# EAGLE design maymusicbox (EAGLE 7.7.0)
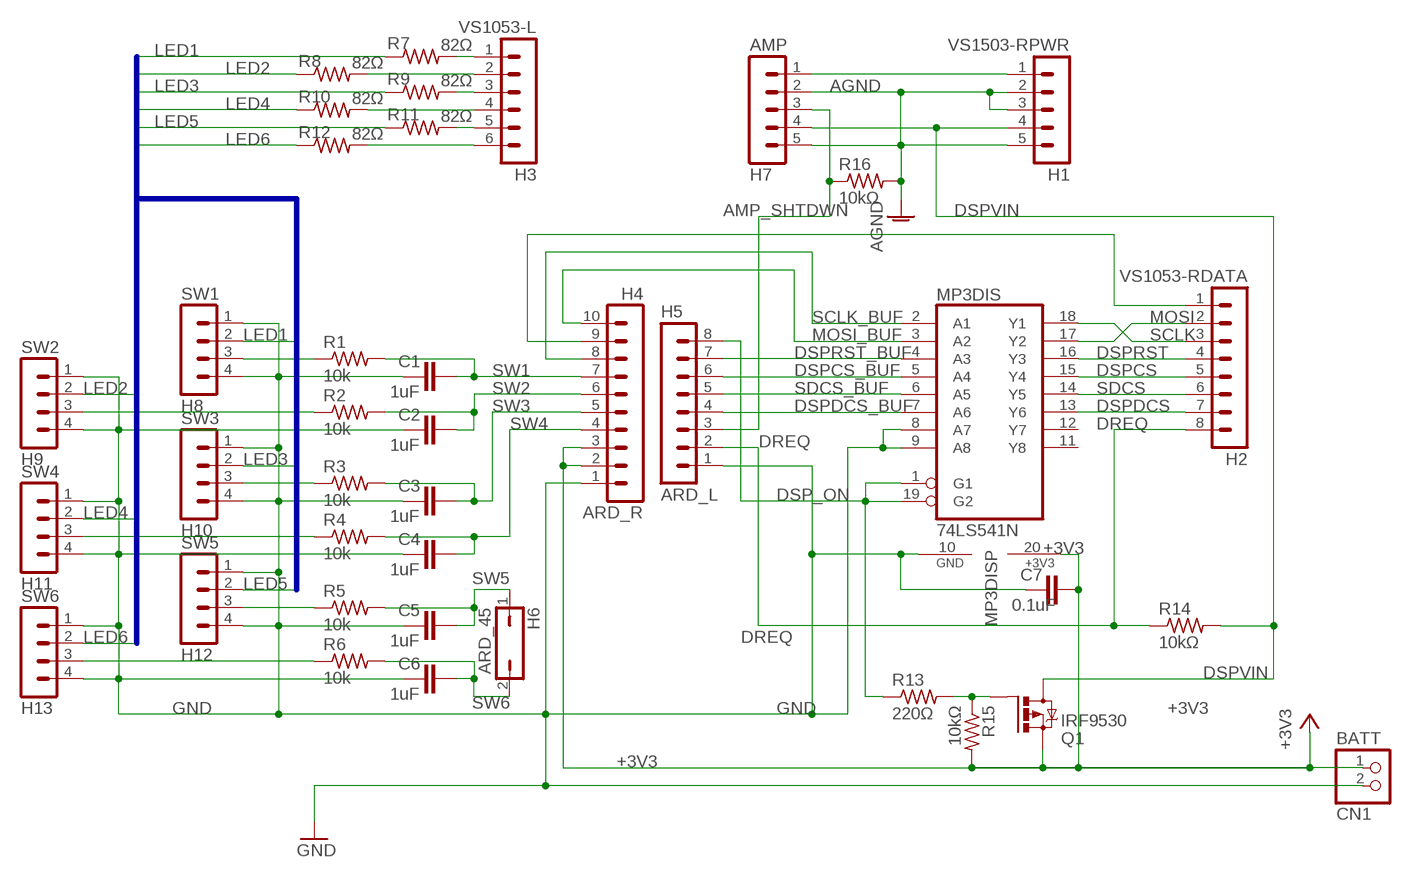
[diagram p0: schematic, sheet 1]

## Parts
C1  1uF  C-EU025-025X050  [C025-025X050]
C2  1uF  C-EU025-025X050  [C025-025X050]
C3  1uF  C-EU025-025X050  [C025-025X050]
C4  1uF  C-EU025-025X050  [C025-025X050]
C5  1uF  C-EU025-025X050  [C025-025X050]
C6  1uF  C-EU025-025X050  [C025-025X050]
C7  0.1uF  C-EU025-025X050  [C025-025X050]
CN1  BATT  JST_2PIN-THM  [JST-PH-2-THM]
H1  VS1503-RPWR  MA05-1  [MA05-1]
H2  VS1053-RDATA  MA08-1  [MA08-1]
H3  VS1053-L  MA06-1  [MA06-1]
H4  ARD_R  MA10-1  [MA10-1]
H5  ARD_L  MA08-1  [MA08-1]
H6  ARD_45  JP1Q  [JP1]
H7  AMP  MA05-1  [MA05-1]
H8  SW1  MA04-1  [MA04-1]
H9  SW2  MA04-1  [MA04-1]
H10  SW3  MA04-1  [MA04-1]
H11  SW4  MA04-1  [MA04-1]
H12  SW5  MA04-1  [MA04-1]
H13  SW6  MA04-1  [MA04-1]
MP3DIS  74LS541N  [DIL20]
Q1  IRF9530  [TO220BV]
R1  10k  R-US_0207/2V  [0207/2V]
R2  10k  R-US_0207/2V  [0207/2V]
R3  10k  R-US_0207/2V  [0207/2V]
R4  10k  R-US_0207/2V  [0207/2V]
R5  10k  R-US_0207/2V  [0207/2V]
R6  10k  R-US_0207/2V  [0207/2V]
R7  82Ω  R-US_0207/2V  [0207/2V]
R8  82Ω  R-US_0207/2V  [0207/2V]
R9  82Ω  R-US_0207/2V  [0207/2V]
R10  82Ω  R-US_0207/2V  [0207/2V]
R11  82Ω  R-US_0207/2V  [0207/2V]
R12  82Ω  R-US_0207/2V  [0207/2V]
R13  220Ω  R-US_0207/2V  [0207/2V]
R14  10kΩ  R-US_0207/2V  [0207/2V]
R15  10kΩ  R-US_0207/2V  [0207/2V]
R16  10kΩ  R-US_0207/2V  [0207/2V]

## Nets
+3V3: C7.2 CN1.1 H4.2 H4.3 MP3DIS.20(+3V3) Q1.S R15.2
A+: H1.1 H7.1
AGND: H1.2 H1.3 H1.5 H7.2 H7.5 R16.2
AMP_SHTDWN: H5.3 H7.3 R16.1
DREQ: H2.8 H5.2 R14.1
DSP_ON: H5.8 MP3DIS.1(G1) MP3DIS.19(G2) R13.1
DSPCS: H2.5 MP3DIS.15(Y4)
DSPCS_BUF: H5.6 MP3DIS.5(A4)
DSPDCS: H2.7 MP3DIS.13(Y6)
DSPDCS_BUF: H5.4 MP3DIS.7(A6)
DSPRST: H2.4 MP3DIS.16(Y3)
DSPRST_BUF: H5.7 MP3DIS.4(A3)
DSPVIN: H1.4 H7.4 Q1.D R14.2
GND: C1.1 C2.1 C3.1 C4.1 C5.1 C6.1 C7.1 CN1.2 H4.1 H5.1 H8.1 H8.4 H9.1 H9.4 H10.1 H10.4 H11.1 H11.4 H12.1 H12.4 H13.1 H13.4 MP3DIS.8(A7) MP3DIS.9(A8) MP3DIS.10(GND)
LED1: H8.2 R7.1
LED2: H9.2 R8.1
LED3: H10.2 R9.1
LED4: H11.2 R10.1
LED5: H12.2 R11.1
LED6: H13.2 R12.1
MISO: H2.1 H4.9
MOSI: H2.2 MP3DIS.17(Y2)
MOSI_BUF: H4.10 MP3DIS.3(A2)
N$1: H3.1 R7.2
N$2: H3.2 R8.2
N$3: Q1.G R13.2 R15.1
N$9: H3.3 R9.2
N$10: H3.4 R10.2
N$11: H3.5 R11.2
N$12: H3.6 R12.2
N$13: H10.3 R3.1
N$14: H9.3 R2.1
N$17: H8.3 R1.1
N$18: H11.3 R4.1
N$20: H12.3 R5.1
N$22: H13.3 R6.1
SCLK: H2.3 MP3DIS.18(Y1)
SCLK_BUF: H4.8 MP3DIS.2(A1)
SDCS: H2.6 MP3DIS.14(Y5)
SDCS_BUF: H5.5 MP3DIS.6(A5)
SW1: C1.2 H4.7 R1.2
SW2: C2.2 H4.6 R2.2
SW3: C3.2 H4.5 R3.2
SW4: C4.2 H4.4 R4.2
SW5: C5.2 H6.1 R5.2
SW6: C6.2 H6.2 R6.2
Unconnected: MP3DIS.11(Y8) MP3DIS.12(Y7)

## Buses
LED[1..6]

## Library data of the parts
C1-C7 = rcl:C-EU: CAPACITOR, European symbol
CN1 = adafruit:JST_2PIN: JST 2-Pin Connectors of various flavors SMT-RA (S2B-PH-SM4) 4UConnector #17311 SMT (B2B-PH-SM4) THM-RA (S2B-PH) THM (B2B-PH)
H1 H7 = con-lstb:MA05-1: PIN HEADER; OC_FARNELL: unknown; OC_NEWARK: unknown
H2 H5 = con-lstb:MA08-1: PIN HEADER; OC_FARNELL: unknown; OC_NEWARK: unknown
H3 = con-lstb:MA06-1: PIN HEADER; OC_FARNELL: unknown; OC_NEWARK: unknown
H4 = con-lstb:MA10-1: PIN HEADER; OC_FARNELL: unknown; OC_NEWARK: unknown
H6 = jumper:JP1Q: JUMPER
H8-H13 = headers:MA04-1: PIN HEADER; OC_FARNELL: unknown; OC_NEWARK: unknown
MP3DIS = May Music Box Parts:74*541: Octal BUFFER and LINE DRIVER, 3-state
Q1 = transistor-power:IRF9530: P-CHANNEL HEXFET POWER-MOS-FET Source: http://www.irf.com/product-info/datasheets/data/irf9530.pdf
R1-R16 = resistor:R-US_: RESISTOR, American symbol

## Board
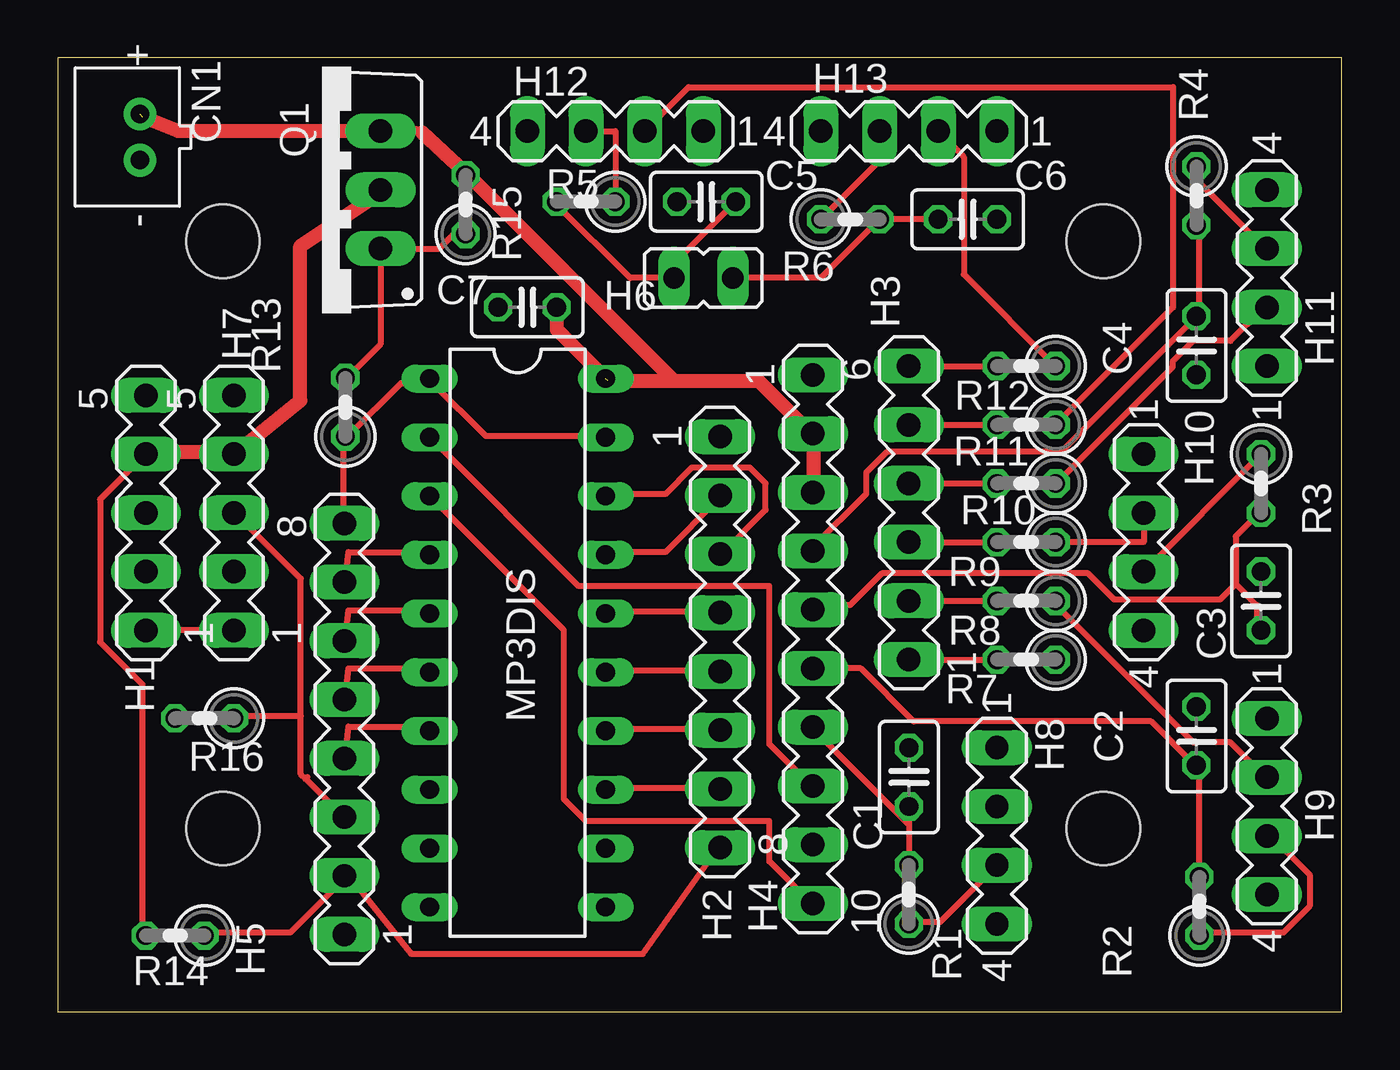
[diagram p1: board, top side]
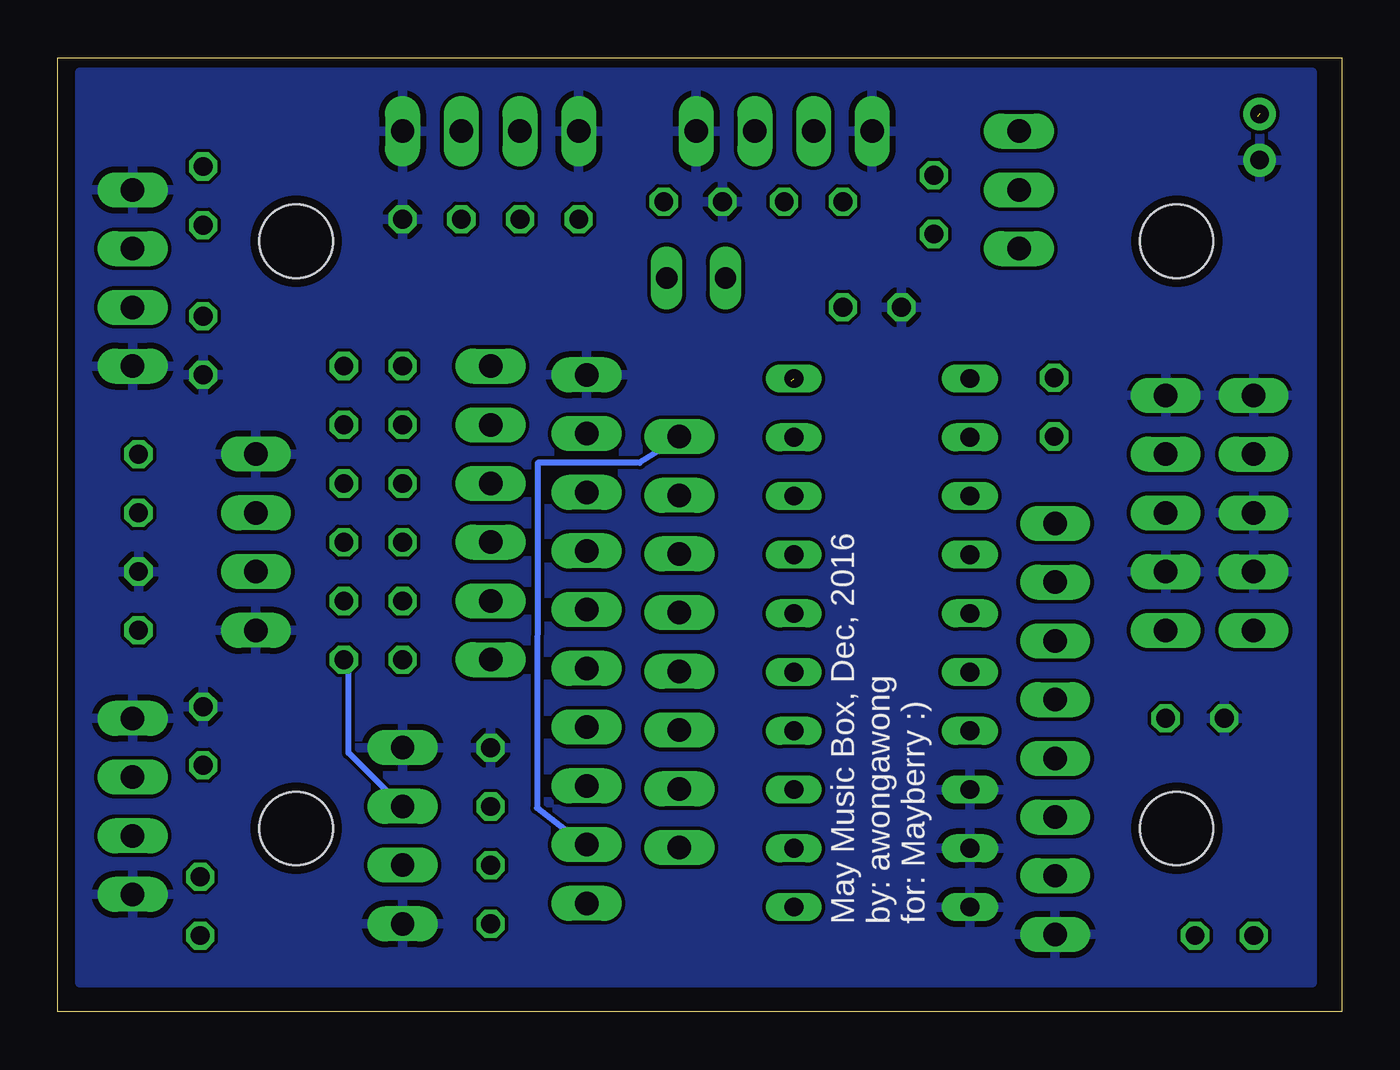
[diagram p2: board, bottom side, seen from below]

Size 55.56 x 41.27 mm. Coordinates in mm from the lower left corner, seen from the top.
Outline: 0,0 55.56,0 55.56,41.27 0,41.27 0,0
Copper layers (1*16): Top 0.0356mm / dielectric 1.5011mm / Bottom 0.0356mm
Design rules "oshpark-2layer": minimum track width 6mil, minimum drill 13mil, track to track 6mil, track to pad 6mil, pad to pad 6mil, via to via 6mil, smd to smd 6mil, copper to edge 15mil, drill to drill 6mil, minimum pad ring 7mil, minimum via ring 7mil, stop-mask expansion 2.5mil, vias tented up to drill 0mil, thermal gap 10mil
Holes 3.17 mm at 7.14,7.94 45.24,7.94 45.24,33.34 7.14,33.34

### Footprints (pad centres in the part's own frame; a part is rotated, then mirrored left to right if it is on the bottom)
C025-025X050 = drill 0.813 octagon: 1 -1.27,0; 2 1.27,0
JST-PH-2-THM = drill 0.8 pad 1.422: 1 1,0; 2 -1,0
MA05-1 = drill 1.016 long: 1 -5.08,0; 2 -2.54,0; 3 0,0; 4 2.54,0; 5 5.08,0
MA08-1 = drill 1.016 long: 1 -8.89,0; 2 -6.35,0; 3 -3.81,0; 4 -1.27,0; 5 1.27,0; 6 3.81,0; 7 6.35,0; 8 8.89,0
MA06-1 = drill 1.016 long: 1 -6.35,0; 2 -3.81,0; 3 -1.27,0; 4 1.27,0; 5 3.81,0; 6 6.35,0
MA10-1 = drill 1.016 long: 1 -11.43,0; 2 -8.89,0; 3 -6.35,0; 4 -3.81,0; 5 -1.27,0; 6 1.27,0; 7 3.81,0; 8 6.35,0; 9 8.89,0; 10 11.43,0
JP1 = drill 0.914 long: 1 0,-1.27; 2 0,1.27
MA04-1 = drill 1.016 long: 1 -3.81,0; 2 -1.27,0; 3 1.27,0; 4 3.81,0
DIL20 = drill 0.813 long: 1 -11.43,-3.81; 2 -8.89,-3.81; 3 -6.35,-3.81; 4 -3.81,-3.81; 5 -1.27,-3.81; 6 1.27,-3.81; 7 3.81,-3.81; 8 6.35,-3.81; 9 8.89,-3.81; 10 11.43,-3.81; 11 11.43,3.81; 12 8.89,3.81; 13 6.35,3.81; 14 3.81,3.81; 15 1.27,3.81; 16 -1.27,3.81; 17 -3.81,3.81; 18 -6.35,3.81; 19 -8.89,3.81; 20 -11.43,3.81
TO220BV = drill 1.016 long: D 0,-2.54; G -2.54,-2.54; S 2.54,-2.54
0207/2V = drill 0.813 octagon: 1 -1.27,0; 2 1.27,0

### Placement (x,y rotation side)
C1  36.83,10.16 270 top
C2  49.28,11.94 270 top
C3  52.07,17.78 270 top
C4  49.28,28.83 90 top
C5  28.07,35.05 0 top
C6  39.37,34.29 180 top
C7  20.32,30.48 0 top
CN1  3.56,37.85 90 top
H1  3.81,21.59 90 top
H2  28.66,16 270 top
H3  36.83,21.59 90 top
H4  32.68,16.13 270 top
H5  12.41,12.24 90 top
H6  27.94,31.75 270 top
H7  7.62,21.59 90 top
H8  40.64,7.62 270 top
H9  52.32,8.89 270 top
H10  46.99,20.32 270 top
H11  52.32,31.75 90 top
H12  24.13,38.1 180 top
H13  36.83,38.1 180 top
MP3DIS  19.9,15.97 270 top
Q1  11.43,35.56 90 top
R1  36.83,5.08 90 top
R2  49.4,4.57 90 top
R3  52.07,22.86 270 top
R4  49.28,35.31 270 top
R5  22.86,35.05 180 top
R6  34.29,34.29 0 top
R7  41.91,15.24 180 top
R8  41.91,17.78 180 top
R9  41.91,20.32 180 top
R10  41.91,22.86 180 top
R11  41.91,25.4 180 top
R12  41.91,27.94 180 top
R13  12.45,26.16 90 top
R14  5.08,3.3 180 top
R15  17.65,34.92 90 top
R16  6.35,12.7 180 top

### Tracks (layer width: path | path; a pad name or v marks a point on that pad's centre or on a via)
+3V3  (2 unrouted)
  Top 0.254: 32.7,22.54 H4.3 | 32.7,24.92 H4.2 32.54,25.08 | 17.78,36.2 R15.2 17.6,36.35 | Q1.S 15.32,38.18 15.54,38.18 15.77,38.05 | 23.65,27.46 MP3DIS.20 | 21.49,30.63 C7.2
  Top 0.61: 3.65,38.73 5.21,38.1 Q1.S 15.24,38.1 | 32.7,24.92 32.7,22.54 | 32.54,25.08 30.32,27.3 26.67,27.3 | 23.81,27.3 26.67,27.3 | 26.67,27.3 17.78,36.2 | 17.6,36.35 15.77,38.05 | 23.65,27.46 21.59,29.53 C7.2
A+
  Top 0.254: H7.1 H1.1
AGND
  pour Bottom: 10.16,10.16 10.16,29.21 1.27,29.21 1.27,10.16
AMP_SHTDWN
  Top 0.254: 10.52,12.8 10.52,10.29 10.72,10.08 | 10.52,12.8 10.52,18.75 7.77,21.49 H7.3 | 10.72,10.08 12.34,8.46 H5.3 | 10.79,10.16 10.72,10.08 | 10.52,12.8 7.77,12.8 R16.1
DREQ
  Top 0.254: H2.8 28.57,7.09 25.32,2.52 15.29,2.52 12.57,5.94 H5.2 12.34,5.71 10.06,3.43 6.4,3.43 R14.1
DSP_ON
  Top 0.254: MP3DIS.19 23.55,24.92 18.52,24.92 16.23,27.2 MP3DIS.1 16,27.2 14.86,27.2 12.57,24.92 R13.1 12.34,24.69 12.34,21.26 H5.8
DSPCS
  Top 0.254: MP3DIS.15 23.81,14.76 28.57,14.76 H2.5
DSPCS_BUF
  Top 0.254: MP3DIS.5 16,17.37 12.57,17.37 H5.6
DSPDCS
  Top 0.254: MP3DIS.13 23.81,9.68 28.57,9.68 H2.7
DSPDCS_BUF
  Top 0.254: MP3DIS.7 16,12.34 12.57,12.34 H5.4
DSPRST
  Top 0.254: MP3DIS.16 23.81,17.3 28.57,17.3 H2.4
DSPRST_BUF
  Top 0.254: MP3DIS.4 16,19.89 12.57,19.89 H5.7
DSPVIN
  Top 0.254: 7.54,24.23 H7.4 7.77,24.23 | 3.89,24.23 H1.4 3.66,24 1.83,22.17 1.83,16 3.66,14.17 3.66,3.43 R14.2 | 13.95,35.43 Q1.D
  Top 0.61: 3.89,24.23 7.54,24.23 | 13.95,35.43 10.49,33.12 10.49,26.44 7.77,24.23
GND
  pour Bottom: 54.61,40.64 54.61,1.27 1.27,1.27 1.27,40.64
LED1
  Bottom 0.254: R7.1 42.98,15.09 42.98,11.2 40.69,8.91 H8.2
LED2
  Top 0.254: R8.1 43.2,17.6 49.15,11.66 50.75,11.66 52.12,10.29 H9.2
LED3
  Top 0.254: R9.1 46.99,20.32 H10.2
LED4
  Top 0.254: R10.1 43.2,22.86 48.23,27.89 48.23,28.12 49.15,29.03 50.75,29.03 52.12,30.4 H11.2
LED5
  Top 0.254: R11.1 48.26,30.48 48.26,40.01 27.3,40.01 H12.2
LED6
  Top 0.254: R12.1 39.21,31.91 39.21,36.99 H13.2
MISO
  Bottom 0.254: H4.9 32.67,7.18 34.83,8.83 34.8,23.75 30.39,23.75 28.73,24.77 H2.1
MOSI
  Top 0.254: MP3DIS.17 23.77,19.89 26.29,19.89 28.57,22.17 H2.2
MOSI_BUF
  Top 0.254: MP3DIS.3 16.19,22.23 21.91,16.51 21.91,9.21 22.86,8.26 30.8,8.26 30.8,6.51 32.54,4.76 H4.10
N$1
  Top 0.254: H3.1 R7.2
N$2
  Top 0.254: H3.2 R8.2
N$3
  Top 0.254: R13.2 12.54,27.46 13.97,28.89 Q1.G 16.51,33.02 17.14,33.66 R15.1
N$9
  Top 0.254: H3.3 R9.2
N$10
  Top 0.254: H3.4 R10.2
N$11
  Top 0.254: H3.5 R11.2
N$12
  Top 0.254: H3.6 R12.2
N$13
  Top 0.254: H10.3 R3.1
N$14
  Top 0.254: R2.1 49.61,3.43 53.03,3.43 54.18,4.57 54.18,5.94 52.58,7.54 H9.3
N$17
  Top 0.254: H8.3 38.18,3.89 37.03,3.89 R1.1
N$18
  Top 0.254: R4.1 49.38,36.58 49.38,35.89 52.12,33.15 H11.3
N$20
  Top 0.254: R5.1 24.13,38.1 H12.3
N$22
  Top 0.254: R6.1 35.56,36.83 H13.3
SCLK
  Top 0.254: 23.77,22.17 MP3DIS.18 23.77,22.4 26.29,22.4 27.43,23.55 29.95,23.55 30.63,22.86 30.63,21.72 28.8,19.89 H2.3 28.57,19.89
SCLK_BUF
  Top 0.254: MP3DIS.2 16.19,24.77 22.54,18.41 30.8,18.41 30.8,11.59 32.54,9.84 H4.8
SDCS
  Top 0.254: MP3DIS.14 23.81,12.22 28.57,12.22 H2.6
SDCS_BUF
  Top 0.254: MP3DIS.6 16,14.86 12.57,14.86 H5.5
SW1
  Top 0.254: C1.2 36.83,8.1 | 36.83,8.1 R1.2 | 36.83,8.1 32.7,12.22 H4.7
SW2
  Top 0.254: R2.2 49.38,5.94 49.38,10.52 C2.2 49.15,10.74 47.32,12.57 37.03,12.57 34.75,14.86 H4.6
SW3
  Top 0.254: 50.98,18.52 51.89,17.6 51.89,16.69 C3.2 | 50.98,18.52 50.98,20.57 51.89,21.49 R3.2 | 50.98,18.52 50.29,17.83 45.72,17.83 44.58,18.97 35.66,18.97 34.29,17.6 32.69,17.6 H4.5
SW4
  Top 0.254: R4.2 49.38,33.83 49.38,30.18 C4.2 49.15,29.95 43.43,24.23 35.89,24.23 34.98,23.32 34.98,22.4 32.69,20.12 H4.4
SW5
  Top 0.254: 26.75,31.77 H6.1 26.04,31.75 | 26.04,31.75 24.77,31.75 21.59,34.92 R5.2 | 26.04,31.75 C5.2
SW6
  Top 0.254: C6.2 R6.2 33.02,31.75 H6.2

### Text on the board
bPlace: May Music Box, Dec, 2016 / by: awongawong / for: Mayberry :)